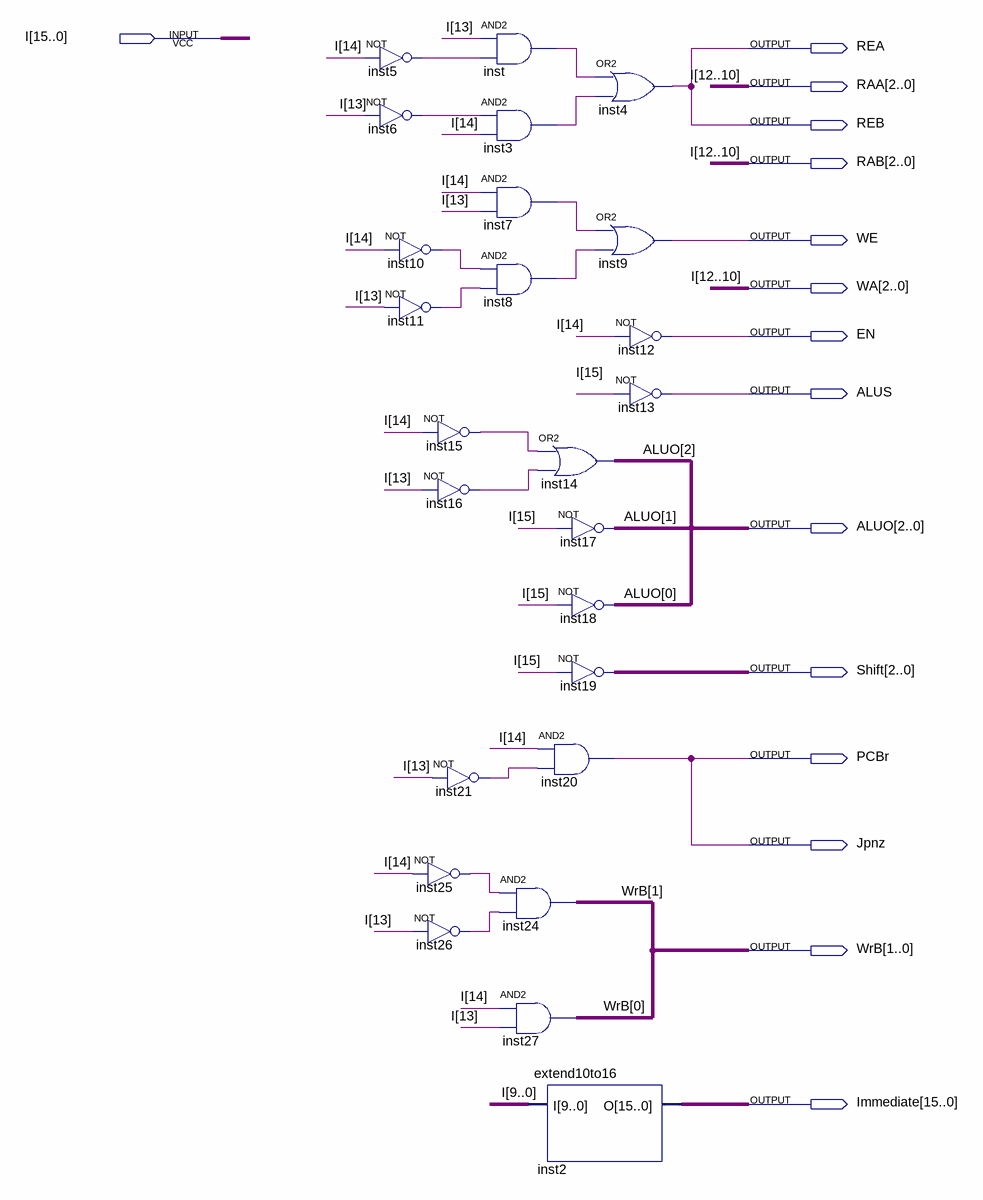
[diagram p0: schematic sheet]
// Quartus schematic RI.bdf as structural Verilog: 25 symbols, 15 pins
module RI (
  input  [15:0] I,
  output REA,
  output [2:0] RAA,
  output REB,
  output [2:0] RAB,
  output WE,
  output [2:0] WA,
  output EN,
  output ALUS,
  output [2:0] ALUO,
  output [2:0] Shift,
  output PCBr,
  output Jpnz,
  output [1:0] WrB,
  output [15:0] Immediate
);

  wire inst3_out, inst5_out, inst6_out, inst7_out, inst8_out, inst10_out, inst11_out, inst15_out, inst16_out,
       inst21_out, inst25_out, inst26_out, inst_out;

  not inst5 (inst5_out, I[14]);
  not inst6 (inst6_out, I[13]);
  not inst10 (inst10_out, I[14]);
  not inst11 (inst11_out, I[13]);
  not inst15 (inst15_out, I[14]);
  not inst16 (inst16_out, I[13]);
  not inst21 (inst21_out, I[13]);
  not inst25 (inst25_out, I[14]);
  not inst26 (inst26_out, I[13]);
  and inst (inst_out, I[13], inst5_out);
  and inst3 (inst3_out, inst6_out, I[14]);
  and inst7 (inst7_out, I[14], I[13]);
  and inst8 (inst8_out, inst10_out, inst11_out);
  or inst14 (ALUO[2], inst15_out, inst16_out);
  and inst20 (Jpnz, I[14], inst21_out);
  and inst24 (WrB[1], inst25_out, inst26_out);
  and inst27 (WrB[0], I[14], I[13]);
  extend10to16 inst2 (.I(I[9:0]), .O(Immediate));
  or inst4 (REA, inst_out, inst3_out);
  or inst9 (WE, inst7_out, inst8_out);
  not inst12 (EN, I[14]);
  not inst13 (ALUS, I[15]);
  not inst17 (ALUO[1], I[15]);
  not inst18 (ALUO[0], I[15]);
  assign Shift = ~{3{I[15]}};  // NOT inst19, 3 bits wide

  assign PCBr = Jpnz;
  assign RAA = I[12:10];
  assign RAB = I[12:10];
  assign REB = REA;
  assign WA = I[12:10];
endmodule
